# Altium schematic sheet 4GLTE.SchDoc
size A; SheetNumber: 5; SheetTotal: 11
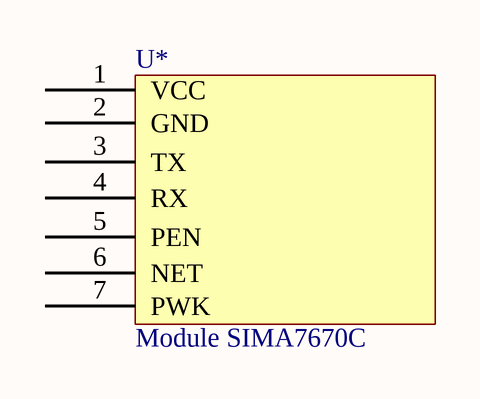
[diagram p0: 4GLTE.SchDoc]

## Parts
U*  Module SIMA7670C  [Module sim7670C]

## Nets

Not connected (* = marked no-connect by the designer): U* 1(VCC) 2(GND) 3(TX) 4(RX) 5(PEN) 6(NET) 7(PWK)